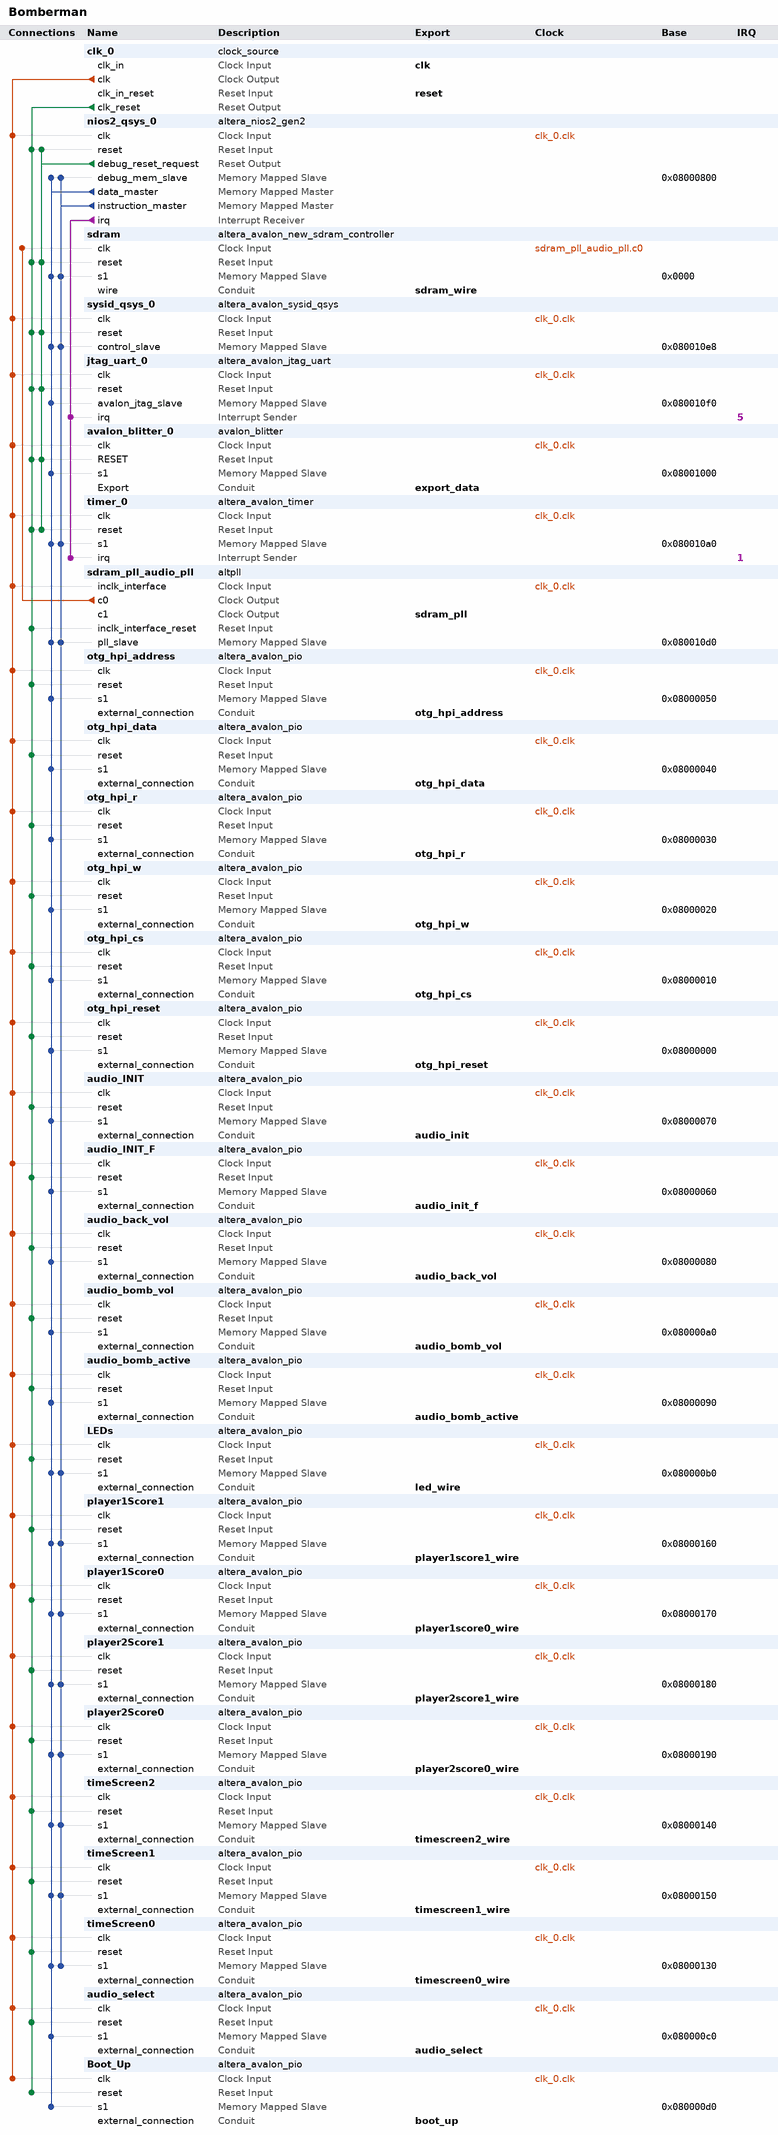
[diagram p0: system contents]
# Platform Designer (Qsys) system Bomberman, Cyclone IV E EP4CE115F29C7
# Parameters at their usual value, and those the tool derives, are not listed.
package require -exact qsys 18.1
create_system Bomberman
set_project_property DEVICE_FAMILY {Cyclone IV E}
set_project_property DEVICE EP4CE115F29C7

add_instance clk_0 clock_source 18.1
set_instance_parameter_value clk_0 clockFrequency 50000000

add_instance nios2_qsys_0 altera_nios2_gen2 18.1
set_instance_parameter_value nios2_qsys_0 dcache_size 2048
set_instance_parameter_value nios2_qsys_0 exceptionSlave sdram.s1
set_instance_parameter_value nios2_qsys_0 icache_size 4096
set_instance_parameter_value nios2_qsys_0 impl Tiny
set_instance_parameter_value nios2_qsys_0 resetSlave sdram.s1

add_instance sdram altera_avalon_new_sdram_controller 18.1
set_instance_parameter_value sdram TAC 5.5
set_instance_parameter_value sdram TRCD 20.0
set_instance_parameter_value sdram TRP 20.0
set_instance_parameter_value sdram casLatency 3
set_instance_parameter_value sdram columnWidth 10
set_instance_parameter_value sdram dataWidth 32
set_instance_parameter_value sdram generateSimulationModel false
set_instance_parameter_value sdram model single_Micron_MT48LC4M32B2_7_chip
set_instance_parameter_value sdram numberOfBanks 4
set_instance_parameter_value sdram numberOfChipSelects 1
set_instance_parameter_value sdram powerUpDelay 200.0
set_instance_parameter_value sdram refreshPeriod 7.8125
set_instance_parameter_value sdram rowWidth 13

add_instance sysid_qsys_0 altera_avalon_sysid_qsys 18.1
set_instance_parameter_value sysid_qsys_0 id 0

add_instance jtag_uart_0 altera_avalon_jtag_uart 18.1
set_instance_parameter_value jtag_uart_0 simInteractiveOptions NO_INTERACTIVE_WINDOWS

add_instance avalon_blitter_0 avalon_blitter 1.0

add_instance timer_0 altera_avalon_timer 18.1
set_instance_parameter_value timer_0 period 1
set_instance_parameter_value timer_0 periodUnits MSEC

add_instance sdram_pll_audio_pll altpll 18.1
set_instance_parameter_value sdram_pll_audio_pll CLK0_DIVIDE_BY 1
set_instance_parameter_value sdram_pll_audio_pll CLK0_MULTIPLY_BY 1
set_instance_parameter_value sdram_pll_audio_pll CLK1_DIVIDE_BY 1
set_instance_parameter_value sdram_pll_audio_pll CLK1_DUTY_CYCLE 50
set_instance_parameter_value sdram_pll_audio_pll CLK1_MULTIPLY_BY 1
set_instance_parameter_value sdram_pll_audio_pll CLK1_PHASE_SHIFT -3000
set_instance_parameter_value sdram_pll_audio_pll CLK2_DIVIDE_BY 3125
set_instance_parameter_value sdram_pll_audio_pll CLK2_DUTY_CYCLE 50
set_instance_parameter_value sdram_pll_audio_pll CLK2_MULTIPLY_BY 1152
set_instance_parameter_value sdram_pll_audio_pll CLK2_PHASE_SHIFT 0
set_instance_parameter_value sdram_pll_audio_pll CLK3_DIVIDE_BY 1
set_instance_parameter_value sdram_pll_audio_pll CLK3_DUTY_CYCLE 50
set_instance_parameter_value sdram_pll_audio_pll CLK3_MULTIPLY_BY 2
set_instance_parameter_value sdram_pll_audio_pll CLK3_PHASE_SHIFT 0
set_instance_parameter_value sdram_pll_audio_pll INCLK0_INPUT_FREQUENCY 20000
set_instance_parameter_value sdram_pll_audio_pll PORT_ARESET PORT_UNUSED
set_instance_parameter_value sdram_pll_audio_pll PORT_LOCKED PORT_UNUSED
set_instance_parameter_value sdram_pll_audio_pll PORT_clk1 PORT_USED
set_instance_parameter_value sdram_pll_audio_pll PORT_clk2 PORT_USED
set_instance_parameter_value sdram_pll_audio_pll PORT_clk3 PORT_USED

add_instance otg_hpi_address altera_avalon_pio 18.1
set_instance_parameter_value otg_hpi_address direction Output
set_instance_parameter_value otg_hpi_address width 2

add_instance otg_hpi_data altera_avalon_pio 18.1
set_instance_parameter_value otg_hpi_data direction InOut
set_instance_parameter_value otg_hpi_data width 16

add_instance otg_hpi_r altera_avalon_pio 18.1
set_instance_parameter_value otg_hpi_r direction Output
set_instance_parameter_value otg_hpi_r width 1

add_instance otg_hpi_w altera_avalon_pio 18.1
set_instance_parameter_value otg_hpi_w direction Output
set_instance_parameter_value otg_hpi_w width 1

add_instance otg_hpi_cs altera_avalon_pio 18.1
set_instance_parameter_value otg_hpi_cs direction Output
set_instance_parameter_value otg_hpi_cs width 1

add_instance otg_hpi_reset altera_avalon_pio 18.1
set_instance_parameter_value otg_hpi_reset direction Output
set_instance_parameter_value otg_hpi_reset width 1

add_instance audio_INIT altera_avalon_pio 18.1
set_instance_parameter_value audio_INIT direction Output
set_instance_parameter_value audio_INIT width 1

add_instance audio_INIT_F altera_avalon_pio 18.1
set_instance_parameter_value audio_INIT_F direction Input
set_instance_parameter_value audio_INIT_F width 1

add_instance audio_back_vol altera_avalon_pio 18.1
set_instance_parameter_value audio_back_vol direction Output
set_instance_parameter_value audio_back_vol width 8

add_instance audio_bomb_vol altera_avalon_pio 18.1
set_instance_parameter_value audio_bomb_vol direction Output
set_instance_parameter_value audio_bomb_vol width 3

add_instance audio_bomb_active altera_avalon_pio 18.1
set_instance_parameter_value audio_bomb_active direction Output
set_instance_parameter_value audio_bomb_active width 1

add_instance LEDs altera_avalon_pio 18.1
set_instance_parameter_value LEDs direction Output
set_instance_parameter_value LEDs width 8

add_instance player1Score1 altera_avalon_pio 18.1
set_instance_parameter_value player1Score1 direction Output
set_instance_parameter_value player1Score1 width 4

add_instance player1Score0 altera_avalon_pio 18.1
set_instance_parameter_value player1Score0 direction Output
set_instance_parameter_value player1Score0 width 4

add_instance player2Score1 altera_avalon_pio 18.1
set_instance_parameter_value player2Score1 direction Output
set_instance_parameter_value player2Score1 width 4

add_instance player2Score0 altera_avalon_pio 18.1
set_instance_parameter_value player2Score0 direction Output
set_instance_parameter_value player2Score0 width 4

add_instance timeScreen2 altera_avalon_pio 18.1
set_instance_parameter_value timeScreen2 direction Output
set_instance_parameter_value timeScreen2 width 4

add_instance timeScreen1 altera_avalon_pio 18.1
set_instance_parameter_value timeScreen1 direction Output
set_instance_parameter_value timeScreen1 width 4

add_instance timeScreen0 altera_avalon_pio 18.1
set_instance_parameter_value timeScreen0 direction Output
set_instance_parameter_value timeScreen0 width 4

add_instance audio_select altera_avalon_pio 18.1
set_instance_parameter_value audio_select direction Output
set_instance_parameter_value audio_select width 3

add_instance Boot_Up altera_avalon_pio 18.1
set_instance_parameter_value Boot_Up direction Input
set_instance_parameter_value Boot_Up width 1

# connections
add_connection clk_0.clk audio_back_vol.clk clock
add_connection clk_0.clk audio_bomb_active.clk clock
add_connection clk_0.clk audio_bomb_vol.clk clock
add_connection clk_0.clk audio_INIT.clk clock
add_connection clk_0.clk audio_INIT_F.clk clock
add_connection clk_0.clk audio_select.clk clock
add_connection clk_0.clk avalon_blitter_0.clk clock
add_connection clk_0.clk Boot_Up.clk clock
add_connection clk_0.clk jtag_uart_0.clk clock
add_connection clk_0.clk LEDs.clk clock
add_connection clk_0.clk nios2_qsys_0.clk clock
add_connection clk_0.clk otg_hpi_address.clk clock
add_connection clk_0.clk otg_hpi_cs.clk clock
add_connection clk_0.clk otg_hpi_data.clk clock
add_connection clk_0.clk otg_hpi_r.clk clock
add_connection clk_0.clk otg_hpi_reset.clk clock
add_connection clk_0.clk otg_hpi_w.clk clock
add_connection clk_0.clk player1Score0.clk clock
add_connection clk_0.clk player1Score1.clk clock
add_connection clk_0.clk player2Score0.clk clock
add_connection clk_0.clk player2Score1.clk clock
add_connection clk_0.clk sdram_pll_audio_pll.inclk_interface clock
add_connection clk_0.clk sysid_qsys_0.clk clock
add_connection clk_0.clk timer_0.clk clock
add_connection clk_0.clk timeScreen0.clk clock
add_connection clk_0.clk timeScreen1.clk clock
add_connection clk_0.clk timeScreen2.clk clock
add_connection sdram_pll_audio_pll.c0 sdram.clk clock
add_connection clk_0.clk_reset audio_back_vol.reset reset
add_connection clk_0.clk_reset audio_bomb_active.reset reset
add_connection clk_0.clk_reset audio_bomb_vol.reset reset
add_connection clk_0.clk_reset audio_INIT.reset reset
add_connection clk_0.clk_reset audio_INIT_F.reset reset
add_connection clk_0.clk_reset audio_select.reset reset
add_connection clk_0.clk_reset avalon_blitter_0.RESET reset
add_connection clk_0.clk_reset Boot_Up.reset reset
add_connection clk_0.clk_reset jtag_uart_0.reset reset
add_connection clk_0.clk_reset LEDs.reset reset
add_connection clk_0.clk_reset nios2_qsys_0.reset reset
add_connection clk_0.clk_reset otg_hpi_address.reset reset
add_connection clk_0.clk_reset otg_hpi_cs.reset reset
add_connection clk_0.clk_reset otg_hpi_data.reset reset
add_connection clk_0.clk_reset otg_hpi_r.reset reset
add_connection clk_0.clk_reset otg_hpi_reset.reset reset
add_connection clk_0.clk_reset otg_hpi_w.reset reset
add_connection clk_0.clk_reset player1Score0.reset reset
add_connection clk_0.clk_reset player1Score1.reset reset
add_connection clk_0.clk_reset player2Score0.reset reset
add_connection clk_0.clk_reset player2Score1.reset reset
add_connection clk_0.clk_reset sdram.reset reset
add_connection clk_0.clk_reset sdram_pll_audio_pll.inclk_interface_reset reset
add_connection clk_0.clk_reset sysid_qsys_0.reset reset
add_connection clk_0.clk_reset timer_0.reset reset
add_connection clk_0.clk_reset timeScreen0.reset reset
add_connection clk_0.clk_reset timeScreen1.reset reset
add_connection clk_0.clk_reset timeScreen2.reset reset
add_connection nios2_qsys_0.debug_reset_request avalon_blitter_0.RESET reset
add_connection nios2_qsys_0.debug_reset_request jtag_uart_0.reset reset
add_connection nios2_qsys_0.debug_reset_request nios2_qsys_0.reset reset
add_connection nios2_qsys_0.debug_reset_request sdram.reset reset
add_connection nios2_qsys_0.debug_reset_request sysid_qsys_0.reset reset
add_connection nios2_qsys_0.debug_reset_request timer_0.reset reset
add_connection nios2_qsys_0.data_master audio_back_vol.s1 avalon
set_connection_parameter_value nios2_qsys_0.data_master/audio_back_vol.s1 baseAddress 0x08000080
add_connection nios2_qsys_0.data_master audio_bomb_active.s1 avalon
set_connection_parameter_value nios2_qsys_0.data_master/audio_bomb_active.s1 baseAddress 0x08000090
add_connection nios2_qsys_0.data_master audio_bomb_vol.s1 avalon
set_connection_parameter_value nios2_qsys_0.data_master/audio_bomb_vol.s1 baseAddress 0x080000a0
add_connection nios2_qsys_0.data_master audio_INIT.s1 avalon
set_connection_parameter_value nios2_qsys_0.data_master/audio_INIT.s1 baseAddress 0x08000070
add_connection nios2_qsys_0.data_master audio_INIT_F.s1 avalon
set_connection_parameter_value nios2_qsys_0.data_master/audio_INIT_F.s1 baseAddress 0x08000060
add_connection nios2_qsys_0.data_master audio_select.s1 avalon
set_connection_parameter_value nios2_qsys_0.data_master/audio_select.s1 baseAddress 0x080000c0
add_connection nios2_qsys_0.data_master avalon_blitter_0.s1 avalon
set_connection_parameter_value nios2_qsys_0.data_master/avalon_blitter_0.s1 baseAddress 0x08001000
add_connection nios2_qsys_0.data_master Boot_Up.s1 avalon
set_connection_parameter_value nios2_qsys_0.data_master/Boot_Up.s1 baseAddress 0x080000d0
add_connection nios2_qsys_0.data_master jtag_uart_0.avalon_jtag_slave avalon
set_connection_parameter_value nios2_qsys_0.data_master/jtag_uart_0.avalon_jtag_slave baseAddress 0x080010f0
add_connection nios2_qsys_0.data_master LEDs.s1 avalon
set_connection_parameter_value nios2_qsys_0.data_master/LEDs.s1 baseAddress 0x080000b0
add_connection nios2_qsys_0.data_master nios2_qsys_0.debug_mem_slave avalon
set_connection_parameter_value nios2_qsys_0.data_master/nios2_qsys_0.debug_mem_slave baseAddress 0x08000800
add_connection nios2_qsys_0.data_master otg_hpi_address.s1 avalon
set_connection_parameter_value nios2_qsys_0.data_master/otg_hpi_address.s1 baseAddress 0x08000050
add_connection nios2_qsys_0.data_master otg_hpi_cs.s1 avalon
set_connection_parameter_value nios2_qsys_0.data_master/otg_hpi_cs.s1 baseAddress 0x08000010
add_connection nios2_qsys_0.data_master otg_hpi_data.s1 avalon
set_connection_parameter_value nios2_qsys_0.data_master/otg_hpi_data.s1 baseAddress 0x08000040
add_connection nios2_qsys_0.data_master otg_hpi_r.s1 avalon
set_connection_parameter_value nios2_qsys_0.data_master/otg_hpi_r.s1 baseAddress 0x08000030
add_connection nios2_qsys_0.data_master otg_hpi_reset.s1 avalon
set_connection_parameter_value nios2_qsys_0.data_master/otg_hpi_reset.s1 baseAddress 0x08000000
add_connection nios2_qsys_0.data_master otg_hpi_w.s1 avalon
set_connection_parameter_value nios2_qsys_0.data_master/otg_hpi_w.s1 baseAddress 0x08000020
add_connection nios2_qsys_0.data_master player1Score0.s1 avalon
set_connection_parameter_value nios2_qsys_0.data_master/player1Score0.s1 baseAddress 0x08000170
add_connection nios2_qsys_0.data_master player1Score1.s1 avalon
set_connection_parameter_value nios2_qsys_0.data_master/player1Score1.s1 baseAddress 0x08000160
add_connection nios2_qsys_0.data_master player2Score0.s1 avalon
set_connection_parameter_value nios2_qsys_0.data_master/player2Score0.s1 baseAddress 0x08000190
add_connection nios2_qsys_0.data_master player2Score1.s1 avalon
set_connection_parameter_value nios2_qsys_0.data_master/player2Score1.s1 baseAddress 0x08000180
add_connection nios2_qsys_0.data_master sdram.s1 avalon
set_connection_parameter_value nios2_qsys_0.data_master/sdram.s1 baseAddress 0x0000
add_connection nios2_qsys_0.data_master sdram_pll_audio_pll.pll_slave avalon
set_connection_parameter_value nios2_qsys_0.data_master/sdram_pll_audio_pll.pll_slave baseAddress 0x080010d0
add_connection nios2_qsys_0.data_master sysid_qsys_0.control_slave avalon
set_connection_parameter_value nios2_qsys_0.data_master/sysid_qsys_0.control_slave baseAddress 0x080010e8
add_connection nios2_qsys_0.data_master timer_0.s1 avalon
set_connection_parameter_value nios2_qsys_0.data_master/timer_0.s1 baseAddress 0x080010a0
add_connection nios2_qsys_0.data_master timeScreen0.s1 avalon
set_connection_parameter_value nios2_qsys_0.data_master/timeScreen0.s1 baseAddress 0x08000130
add_connection nios2_qsys_0.data_master timeScreen1.s1 avalon
set_connection_parameter_value nios2_qsys_0.data_master/timeScreen1.s1 baseAddress 0x08000150
add_connection nios2_qsys_0.data_master timeScreen2.s1 avalon
set_connection_parameter_value nios2_qsys_0.data_master/timeScreen2.s1 baseAddress 0x08000140
add_connection nios2_qsys_0.instruction_master LEDs.s1 avalon
set_connection_parameter_value nios2_qsys_0.instruction_master/LEDs.s1 baseAddress 0x080000b0
add_connection nios2_qsys_0.instruction_master nios2_qsys_0.debug_mem_slave avalon
set_connection_parameter_value nios2_qsys_0.instruction_master/nios2_qsys_0.debug_mem_slave baseAddress 0x08000800
add_connection nios2_qsys_0.instruction_master player1Score0.s1 avalon
set_connection_parameter_value nios2_qsys_0.instruction_master/player1Score0.s1 baseAddress 0x08000170
add_connection nios2_qsys_0.instruction_master player1Score1.s1 avalon
set_connection_parameter_value nios2_qsys_0.instruction_master/player1Score1.s1 baseAddress 0x08000160
add_connection nios2_qsys_0.instruction_master player2Score0.s1 avalon
set_connection_parameter_value nios2_qsys_0.instruction_master/player2Score0.s1 baseAddress 0x08000190
add_connection nios2_qsys_0.instruction_master player2Score1.s1 avalon
set_connection_parameter_value nios2_qsys_0.instruction_master/player2Score1.s1 baseAddress 0x08000180
add_connection nios2_qsys_0.instruction_master sdram.s1 avalon
set_connection_parameter_value nios2_qsys_0.instruction_master/sdram.s1 baseAddress 0x0000
add_connection nios2_qsys_0.instruction_master sdram_pll_audio_pll.pll_slave avalon
set_connection_parameter_value nios2_qsys_0.instruction_master/sdram_pll_audio_pll.pll_slave baseAddress 0x080010d0
add_connection nios2_qsys_0.instruction_master sysid_qsys_0.control_slave avalon
set_connection_parameter_value nios2_qsys_0.instruction_master/sysid_qsys_0.control_slave baseAddress 0x080010e8
add_connection nios2_qsys_0.instruction_master timer_0.s1 avalon
set_connection_parameter_value nios2_qsys_0.instruction_master/timer_0.s1 baseAddress 0x080010a0
add_connection nios2_qsys_0.instruction_master timeScreen0.s1 avalon
set_connection_parameter_value nios2_qsys_0.instruction_master/timeScreen0.s1 baseAddress 0x08000130
add_connection nios2_qsys_0.instruction_master timeScreen1.s1 avalon
set_connection_parameter_value nios2_qsys_0.instruction_master/timeScreen1.s1 baseAddress 0x08000150
add_connection nios2_qsys_0.instruction_master timeScreen2.s1 avalon
set_connection_parameter_value nios2_qsys_0.instruction_master/timeScreen2.s1 baseAddress 0x08000140
add_connection nios2_qsys_0.irq jtag_uart_0.irq interrupt
set_connection_parameter_value nios2_qsys_0.irq/jtag_uart_0.irq irqNumber 5
add_connection nios2_qsys_0.irq timer_0.irq interrupt
set_connection_parameter_value nios2_qsys_0.irq/timer_0.irq irqNumber 1

# exported interfaces
add_interface audio_back_vol conduit end
set_interface_property audio_back_vol EXPORT_OF audio_back_vol.external_connection
add_interface audio_bomb_active conduit end
set_interface_property audio_bomb_active EXPORT_OF audio_bomb_active.external_connection
add_interface audio_bomb_vol conduit end
set_interface_property audio_bomb_vol EXPORT_OF audio_bomb_vol.external_connection
add_interface audio_init conduit end
set_interface_property audio_init EXPORT_OF audio_INIT.external_connection
add_interface audio_init_f conduit end
set_interface_property audio_init_f EXPORT_OF audio_INIT_F.external_connection
add_interface audio_select conduit end
set_interface_property audio_select EXPORT_OF audio_select.external_connection
add_interface boot_up conduit end
set_interface_property boot_up EXPORT_OF Boot_Up.external_connection
add_interface clk clock sink
set_interface_property clk EXPORT_OF clk_0.clk_in
add_interface export_data conduit end
set_interface_property export_data EXPORT_OF avalon_blitter_0.Export
add_interface led_wire conduit end
set_interface_property led_wire EXPORT_OF LEDs.external_connection
add_interface otg_hpi_address conduit end
set_interface_property otg_hpi_address EXPORT_OF otg_hpi_address.external_connection
add_interface otg_hpi_cs conduit end
set_interface_property otg_hpi_cs EXPORT_OF otg_hpi_cs.external_connection
add_interface otg_hpi_data conduit end
set_interface_property otg_hpi_data EXPORT_OF otg_hpi_data.external_connection
add_interface otg_hpi_r conduit end
set_interface_property otg_hpi_r EXPORT_OF otg_hpi_r.external_connection
add_interface otg_hpi_reset conduit end
set_interface_property otg_hpi_reset EXPORT_OF otg_hpi_reset.external_connection
add_interface otg_hpi_w conduit end
set_interface_property otg_hpi_w EXPORT_OF otg_hpi_w.external_connection
add_interface player1score0_wire conduit end
set_interface_property player1score0_wire EXPORT_OF player1Score0.external_connection
add_interface player1score1_wire conduit end
set_interface_property player1score1_wire EXPORT_OF player1Score1.external_connection
add_interface player2score0_wire conduit end
set_interface_property player2score0_wire EXPORT_OF player2Score0.external_connection
add_interface player2score1_wire conduit end
set_interface_property player2score1_wire EXPORT_OF player2Score1.external_connection
add_interface reset reset sink
set_interface_property reset EXPORT_OF clk_0.clk_in_reset
add_interface sdram_pll clock source
set_interface_property sdram_pll EXPORT_OF sdram_pll_audio_pll.c1
add_interface sdram_wire conduit end
set_interface_property sdram_wire EXPORT_OF sdram.wire
add_interface timescreen0_wire conduit end
set_interface_property timescreen0_wire EXPORT_OF timeScreen0.external_connection
add_interface timescreen1_wire conduit end
set_interface_property timescreen1_wire EXPORT_OF timeScreen1.external_connection
add_interface timescreen2_wire conduit end
set_interface_property timescreen2_wire EXPORT_OF timeScreen2.external_connection

set_interconnect_requirement {$system} qsys_mm.clockCrossingAdapter HANDSHAKE
set_interconnect_requirement {$system} qsys_mm.enableEccProtection FALSE
set_interconnect_requirement {$system} qsys_mm.insertDefaultSlave FALSE
set_interconnect_requirement {$system} qsys_mm.maxAdditionalLatency 1

save_system Bomberman.qsys
